# EAGLE schematic DBClock (EAGLE 7.6.0)
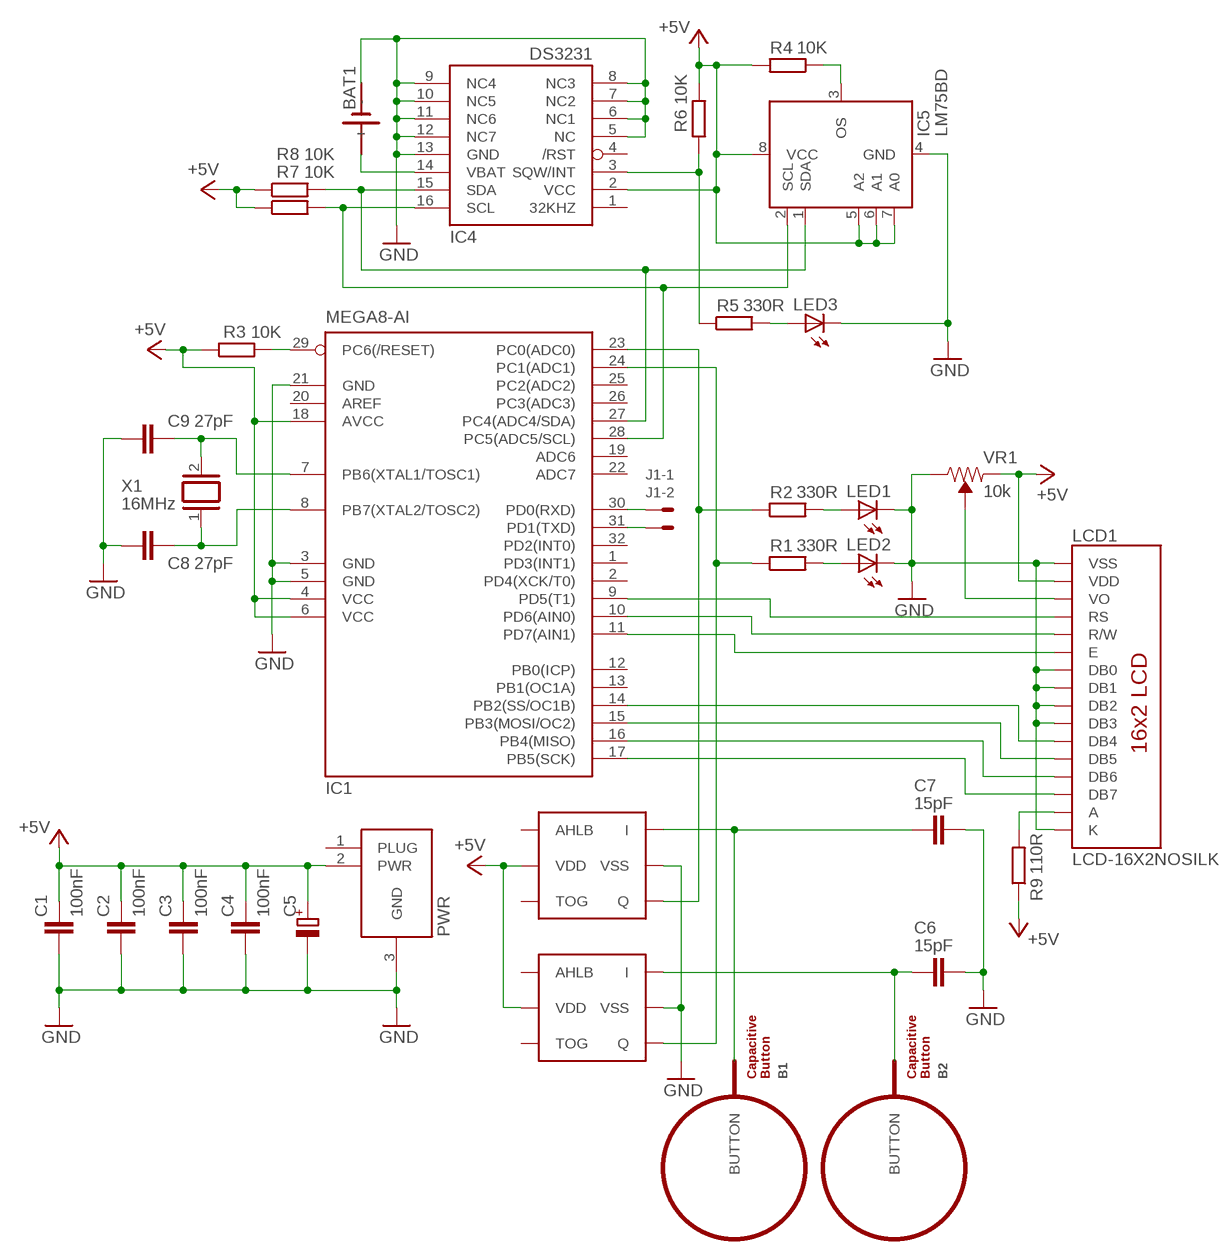
[diagram p0: schematic, sheet 1]

## Parts
B1  BUTTON_PASSIVE6MM  [BUTTON_PASSIVE_6MM]
B2  BUTTON_PASSIVE6MM  [BUTTON_PASSIVE_6MM]
BAT1  SN2032  [SN2032]
C1  100nF  C-EUC0805K  [C0805K]
C2  100nF  C-EUC0805K  [C0805K]
C3  100nF  C-EUC0805K  [C0805K]
C4  100nF  C-EUC0805K  [C0805K]
C5  CPOL-EU153CLV-0810  [153CLV-0810]
C6  15pF  C-EUC0805K  [C0805K]
C7  15pF  C-EUC0805K  [C0805K]
C8  27pF  C-EUC0805K  [C0805K]
C9  27pF  C-EUC0805K  [C0805K]
IC1  MEGA8-AI  [TQFP32-08]
IC2  TTP223-BA6  [BA6]
IC3  TTP223-BA6  [BA6]
IC4  DS3231/SO  [SO16W]
IC5  LM75BD  [SOT96-1]
J1  22-27-2021-02  [6410-02]
LCD1  LCD-16X2NOSILK  [LCD-16X2_NOSILK]
LED1  LEDSML0805  [SML0805]
LED2  LEDSML0805  [SML0805]
LED3  LEDSML0805  [SML0805]
PWR  DCJACK-21MM  [DC-21MM]
R1  330R  R-EU_M0805  [M0805]
R2  330R  R-EU_M0805  [M0805]
R3  10K  R-EU_M0805  [M0805]
R4  10K  R-EU_M0805  [M0805]
R5  330R  R-EU_M0805  [M0805]
R6  10K  R-EU_M0805  [M0805]
R7  10K  R-EU_M0805  [M0805]
R8  10K  R-EU_M0805  [M0805]
R9  110R  R-EU_M0805  [M0805]
VR1  10k  TRIMPOT-PTH-10MM-KNOB-1/2W-10%  [TRIMPOT-PTH-3386U]
X1  16MHz  XTAL/S  [QS]

## Nets
+5V: C1.1 C2.1 C3.1 C4.1 C5.+ IC1.4(VCC) IC1.6(VCC) IC1.18(AVCC) IC2.VDD IC3.VDD IC4.2(VCC) IC5.5(A2) IC5.6(A1) IC5.7(A0) IC5.8(VCC) LCD1.2(VDD) PWR.2(PWR) R3.1 R4.2 R6.2 R7.1 R8.1 R9.1 VR1.1(CCW)
GND: BAT1.- C1.2 C2.2 C3.2 C4.2 C5.- C6.1 C7.1 C8.1 C9.1 IC1.3(GND) IC1.5(GND) IC1.21(GND) IC2.VSS IC3.VSS IC4.5(NC) IC4.6(NC1) IC4.7(NC2) IC4.8(NC3) IC4.9(NC4) IC4.10(NC5) IC4.11(NC6) IC4.12(NC7) IC4.13(GND) IC5.4(GND) LCD1.1(VSS) LCD1.7(DB0) LCD1.8(DB1) LCD1.9(DB2) LCD1.10(DB3) LCD1.16(K) LED1.C LED2.C LED3.C PWR.3(GND) VR1.3(CW)
N$1: C9.2 IC1.7(PB6(XTAL1/TOSC1)) X1.2
N$2: IC1.9(PD5(T1)) LCD1.4(RS)
N$3: LED3.A R5.2
N$4: IC1.29(PC6(/RESET)) R3.2
N$5: C8.2 IC1.8(PB7(XTAL2/TOSC2)) X1.1
N$6: IC1.10(PD6(AIN0)) LCD1.5(R/W)
N$7: IC1.11(PD7(AIN1)) LCD1.6(E)
N$8: IC1.17(PB5(SCK)) LCD1.14(DB7)
N$9: IC1.16(PB4(MISO)) LCD1.13(DB6)
N$10: IC1.15(PB3(MOSI/OC2)) LCD1.12(DB5)
N$11: IC1.14(PB2(SS/OC1B)) LCD1.11(DB4)
N$12: IC1.28(PC5(ADC5/SCL)) IC4.16(SCL) IC5.2(SCL) R7.2
N$13: LCD1.3(VO) VR1.2(WIPER)
N$14: IC1.27(PC4(ADC4/SDA)) IC4.15(SDA) IC5.1(SDA) R8.2
N$15: B1.BUTTON C7.2 IC2.I
N$16: B2.BUTTON C6.2 IC3.I
N$17: IC1.23(PC0(ADC0)) IC2.Q R2.1
N$18: IC1.31(PD1(TXD)) J1.2
N$19: IC5.3(OS) R4.1
N$20: IC1.24(PC1(ADC1)) IC3.Q R1.1
N$21: LED2.A R1.2
N$22: LED1.A R2.2
N$23: IC1.30(PD0(RXD)) J1.1
N$24: BAT1.+ IC4.14(VBAT)
N$26: LCD1.15(A) R9.2
N$38: IC4.3(SQW/INT) R5.1 R6.1
Unconnected: IC1.1(PD3(INT1)) IC1.2(PD4(XCK/T0)) IC1.12(PB0(ICP)) IC1.13(PB1(OC1A)) IC1.19(ADC6) IC1.20(AREF) IC1.22(ADC7) IC1.25(PC2(ADC2)) IC1.26(PC3(ADC3)) IC1.32(PD2(INT0)) IC2.AHLB IC2.TOG IC3.AHLB IC3.TOG IC4.1(32KHZ) IC4.4(/RST) PWR.1(PLUG)

## Library data of the parts
B1 B2 = PatternAgents-TouchWidgets:BUTTON_PASSIVE: Button, Passive Capacitive/Touch Sensing Type Source : http://www.PatternAgents.com Github : https://github.com/PatternAgents License : http://creativecommons.org/licenses/by-sa/3.1/ (Creative Commons 3.1) THIS SOFTWARE IS PROVIDED BY THE CONTRIBUTORS "AS IS" AND WITHOUT ANY EXPRESS OR IMPLIED WARRANTIES, INCLUDING, BUT NOT LIMITED TO, THE IMPLIED WARRANTIES OF MERCHANTABILITY AND FITNESS FOR A PARTICULAR PURPOSE ARE DISCLAIMED. IN NO EVENT SHALL THE COPYRIGHT OWNER OR CONTRIBUTORS BE LIABLE FOR ANY DIRECT, INDIRECT, INCIDENTAL, SPECIAL, EXEMPLARY, OR CONSEQUENTIAL DAMAGES (INCLUDING, BUT NOT LIMITED TO, PROCUREMENT OF SUBSTITUTE GOODS OR SERVICES; LOSS OF USE, DATA, OR PROFITS; OR BUSINESS INTERRUPTION) HOWEVER CAUSED AND ON ANY THEORY OF LIABILITY, WHETHER IN CONTRACT, STRICT LIABILITY, OR TORT (INCLUDING NEGLIGENCE OR OTHERWISE) ARISING IN ANY WAY OUT OF THE USE OF THIS SOFTWARE, EVEN IF ADVISED OF THE POSSIBILITY OF SUCH DAMAGE.
BAT1 = sn2032:SN2032: LI BATTERY
C1-C4 C6-C9 = rcl:C-EU: CAPACITOR, European symbol
C5 = rcl:CPOL-EU: POLARIZED CAPACITOR, European symbol
IC1 = atmel:MEGA8: MICROCONTROLLER 8 Kbytes FLASH, 1 kbytes SRAM, 512 bytes EEPROM, USART, 6-channel 10 bit ADC, 2-channel 8 bit ADC Pin compatible with Atmega48, ATMega88, ATMega168 Source: avr.lbr
IC2 IC3 = TTP223:TTP223-BA6
IC4 = adafruit:DS3231
IC5 = NXP_60_26022015:LM75B: Digital temperature sensor and thermal watchdog AAL Eindhoven MK
J1 = con-molex:22-?-02: CONNECTOR wire to board 2.54 mm (.1 inch) pitch header; OC_FARNELL: unknown; OC_NEWARK: unknown
LCD1 = SparkFun-Displays:LCD-16X2: Standard text-only 16x2 parallel input LCD Basic 16 character by 2 line display. Typically utilizes the extremely common HD44780 parallel interface chipset SparkFun Products: Basic 16x2 Green <https://www.sparkfun.com/products/255> Basic 8x2 Green <https://www.sparkfun.com/products/11122>; SF_ID: LCD-00255
LED1-LED3 = led:LED: LED OSRAM: - CHIPLED LG R971, LG N971, LY N971, LG Q971, LY Q971, LO R971, LY R971 LH N974, LH R974 LS Q976, LO Q976, LY Q976 LO Q996 - Hyper CHIPLED LW Q18S LB Q993, LB Q99A, LB R99A - SideLED LS A670, LO A670, LY A670, LG A670, LP A670 LB A673, LV A673, LT A673, LW A673 LH A674 LY A675 LS A676, LA A676, LO A676, LY A676, LW A676 LS A679, LY A679, LG A679 - Hyper Micro SIDELED® LS Y876, LA Y876, LO Y876, LY Y876 LT Y87S - SmartLED LW L88C, LW L88S LB L89C, LB L89S, LG L890 LS L89K, LO L89K, LY L89K LS L896, LA L896, LO L896, LY L896 - TOPLED LS T670, LO T670, LY T670, LG T670, LP T670 LSG T670, LSP T670, LSY T670, LOP T670, LYG T670 LG T671, LOG T671, LSG T671 LB T673, LV T673, LT T673, LW T673 LH T674 LS T676, LA T676, LO T676, LY T676, LB T676, LH T676, LSB T676, LW T676 LB T67C, LV T67C, LT T67C, LS T67K, LO T67K, LY T67K, LW E67C LS E67B, LA E67B, LO E67B, LY E67B, LB E67C, LV E67C, LT E67C LW T67C LS T679, LY T679, LG T679 LS T770, LO T770, LY T770, LG T770, LP T770 LB T773, LV T773, LT T773, LW T773 LH T774 LS E675, LA E675, LY E675, LS T675 LS T776, LA T776, LO T776, LY T776, LB T776 LHGB T686 LT T68C, LB T68C - Hyper Mini TOPLED® LB M676 - Mini TOPLED Santana® LG M470 LS M47K, LO M47K, LY M47K Source: http://www.osram.convergy.de LUXEON: - LUMILED® LXK2-PW12-R00, LXK2-PW12-S00, LXK2-PW14-U00, LXK2-PW14-V00 LXK2-PM12-R00, LXK2-PM12-S00, LXK2-PM14-U00 LXK2-PE12-Q00, LXK2-PE12-R00, LXK2-PE12-S00, LXK2-PE14-T00, LXK2-PE14-U00 LXK2-PB12-K00, LXK2-PB12-L00, LXK2-PB12-M00, LXK2-PB14-N00, LXK2-PB14-P00, LXK2-PB14-Q00 LXK2-PR12-L00, LXK2-PR12-M00, LXK2-PR14-Q00, LXK2-PR14-R00 LXK2-PD12-Q00, LXK2-PD12-R00, LXK2-PD12-S00 LXK2-PH12-R00, LXK2-PH12-S00 LXK2-PL12-P00, LXK2-PL12-Q00, LXK2-PL12-R00 Source: www.luxeon.com KINGBRIGHT: KA-3528ASYC Source: www.kingbright.com
PWR = powersupply:DCJACK: 2.1mm DC Power Jack Mouser Part No. 163-5004
R1-R9 = resistor:R-EU_: RESISTOR, European symbol
VR1 = SparkFun-Resistors:TRIMPOT: Trimming Potentiometer (Trimpot) Three-terminal potentiometers, with an adjustable wiper and two adjustable resistors. A pot can be used to create a configurable voltage divider, or as a variable resistor. "Trimpots" are a subset of potentiometers, usually intended for "set-and-forget" applications. They're often more delicate than standard potentiometers - rated for fewer turns. Variants PTH-KNOB - PTH Trimpot w/ finger-adjustable knob Trimpot 10K with Knob <https://www.sparkfun.com/products/9806> (COM-09806) Datasheet <http://www.sparkfun.com/datasheets/Components/General/TSR-3386.pdf> SMD-3MM-CLOSED-FRAME - SMD 3mm Square Closed-Frame Trimpot Used on e.g. EasyDriver - Stepper Motor Driver <https://www.sparkfun.com/products/12779> Datasheet <http://www.bitechnologies.com/pdfs/22.pdf> (22AR10KTR) SMD-5MM - SMD 5mm Square Closed-Frame Trimpot Used on e.g. IOIO-OTG - V2.2 <https://www.sparkfun.com/products/13613> Datasheet <http://www.vishay.com/docs/51008/ts53.pdf> (TS53YL502MR10) SMD-3MM-1/10W-25% - 3mm Square Open-Frame Trimpot Used on e.g. SparkFun Shapeoko <https://www.sparkfun.com/products/13899> Datasheet <http://www.bourns.com/docs/Product-Datasheets/TC33.pdf> (TC33X-2-103E); PROD_ID: RES-09730; SF_SKU: COM-09806
X1 = special:XTAL/S: CRYSTAL